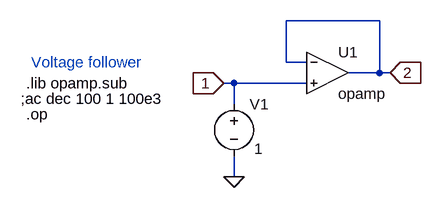
[diagram p0: schematic voltage follower.asc]
voltage follower.asc, the LTspice schematic file:
Version 4
SHEET 1 880 680
WIRE 208 -16 64 -16
WIRE 64 48 64 -16
WIRE 96 48 64 48
WIRE 208 64 208 -16
WIRE 208 64 160 64
WIRE 224 64 208 64
WIRE -16 80 -32 80
WIRE 96 80 -16 80
WIRE -16 112 -16 80
WIRE -16 224 -16 192
FLAG -16 224 0
FLAG -32 80 1
IOPIN -32 80 In
FLAG 224 64 2
IOPIN 224 64 In
SYMBOL voltage -16 96 R0
WINDOW 123 29 90 Left 2
WINDOW 39 0 0 Left 0
WINDOW 3 31 85 Left 2
SYMATTR Value 1
SYMATTR InstName V1
SYMBOL OpAmps\\opamp 128 0 R0
SYMATTR InstName U1
TEXT -336 80 Left 2 !.lib opamp.sub
TEXT -344 104 Left 2 !;ac dec 100 1 100e3
TEXT -328 48 Left 2 ;Voltage follower
TEXT -336 128 Left 2 !.op

The netlist it stands for:
* voltage follower.asc
V1 1 0 1
XU1 2 1 2 opamp Aol=100K GBW=10Meg  ; pins invin noninvin out
.lib opamp.sub
;ac dec 100 1 100e3
* Voltage follower
.op
.backanno
.end